# Altium schematic sheet LCD16x2.SchDoc
size A3; SheetNumber: 1; SheetTotal: 1
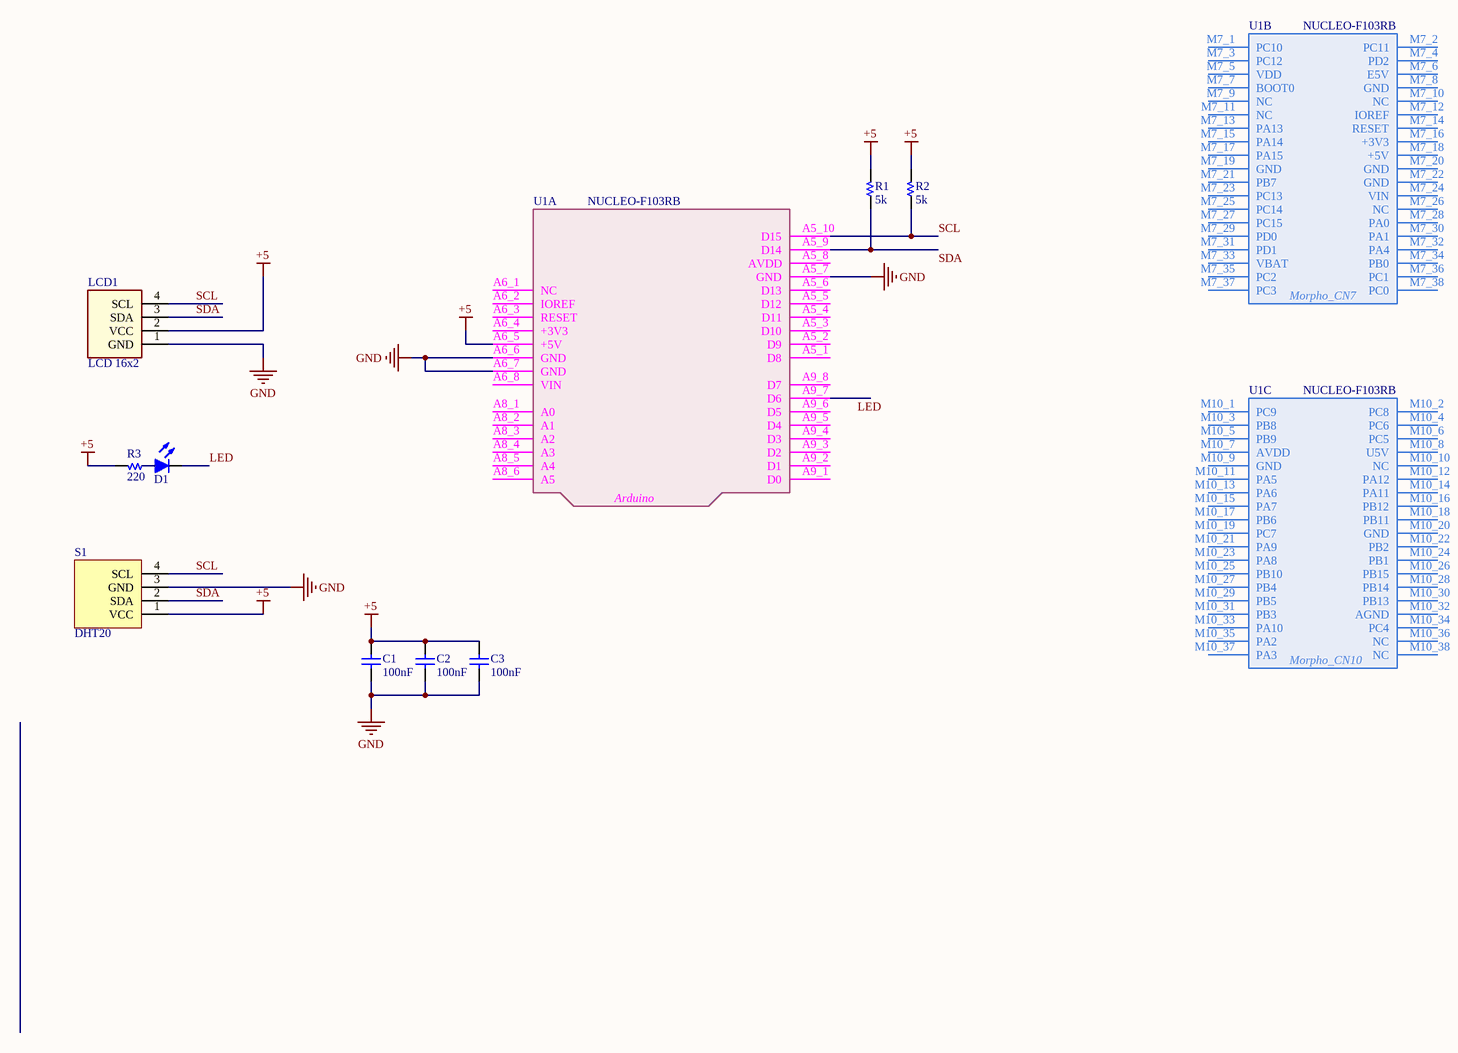
[diagram p0: LCD16x2.SchDoc]

## Parts
C1  100nF  [C 0805]
C2  100nF  [C 0805]
C3  100nF  [C 0805]
D1  Led  [LED 3MM - red]  (value not drawn)
LCD1  LCD 16x2  [LCD 1602A I2C]
R1  5k  [R 0805]
R2  5k  [R 0805]
R3  220  [R 0805]
S1  DHT20  [DTH20]
U1  NUCLEO-F103RB  [NUCLEO]  (parts A,B,C of 3)

## Nets
+5: C1.1 C2.1 C3.1 LCD1.2(VCC) R1.2 R2.2 R3.2 S1.1(VCC) U1.A6_5(+5V)
GND: C1.2 C2.2 C3.2 LCD1.1(GND) S1.3(GND) U1.A5_7(GND) U1.A6_6(GND) U1.A6_7(GND)
LED: D1.2(K) U1.A9_7(D6)
SCL: LCD1.4(SCL) R2.1 S1.4(SCL) U1.A5_10(D15)
SDA: LCD1.3(SDA) R1.1 S1.2(SDA) U1.A5_9(D14)
NetD1_1: D1.1(A) R3.1

Not connected (* = marked no-connect by the designer): U1 A5_1(D8) A5_2(D9) A5_3(D10) A5_4(D11) A5_5(D12) A5_6(D13) A5_8(AVDD) A6_1(NC) A6_2(IOREF) A6_3(RESET) A6_4(+3V3) A6_8(VIN) A8_1(A0) A8_2(A1) A8_3(A2) A8_4(A3) A8_5(A4) A8_6(A5) A9_1(D0) A9_2(D1) A9_3(D2) A9_4(D3) A9_5(D4) A9_6(D5) A9_8(D7) M7_1(PC10) M7_2(PC11) M7_3(PC12) M7_4(PD2) M7_5(VDD) M7_6(E5V) M7_7(BOOT0) M7_8(GND) M7_9(NC) M7_10(NC) M7_11(NC) M7_12(IOREF) M7_13(PA13) M7_14(RESET) M7_15(PA14) M7_16(+3V3) M7_17(PA15) M7_18(+5V) M7_19(GND) M7_20(GND) M7_21(PB7) M7_22(GND) M7_23(PC13) M7_24(VIN) M7_25(PC14) M7_26(NC) M7_27(PC15) M7_28(PA0) M7_29(PD0) M7_30(PA1) M7_31(PD1) M7_32(PA4) M7_33(VBAT) M7_34(PB0) M7_35(PC2) M7_36(PC1) M7_37(PC3) M7_38(PC0) M10_1(PC9) M10_2(PC8) M10_3(PB8) M10_4(PC6) M10_5(PB9) M10_6(PC5) M10_7(AVDD) M10_8(U5V) M10_9(GND) M10_10(NC) M10_11(PA5) M10_12(PA12) M10_13(PA6) M10_14(PA11) M10_15(PA7) M10_16(PB12) M10_17(PB6) M10_18(PB11) M10_19(PC7) M10_20(GND) M10_21(PA9) M10_22(PB2) M10_23(PA8) M10_24(PB1) M10_25(PB10) M10_26(PB15) M10_27(PB4) M10_28(PB14) M10_29(PB5) M10_30(PB13) M10_31(PB3) M10_32(AGND) M10_33(PA10) M10_34(PC4) M10_35(PA2) M10_36(NC) M10_37(PA3) M10_38(NC)

## Notes on the sheet
- (in symbol NUCLEO-F103RB, part A) Arduino
- (in symbol NUCLEO-F103RB, part B) Morpho_CN7
- (in symbol NUCLEO-F103RB, part C) Morpho_CN10

## Library data of the parts
C1-C3 = Capacitor NP: Capacitor non-pol
D1 = Led: Typical LED
LCD1 = LCD 16x2: Character LCD 16x2
R1-R3 = Resistor
S1 = DTH20: DTH20 Temperature and humidity module
U1 = NUCLEO-F103RB: STM32F103RB, mbed-Enabled Development Nucleo-64 STM32F1 ARM® Cortex®-M3 MCU 32-Bit Embedded Evaluation Board; Manufacturer: STMicroelectronics; Manufacturer Product Number: NUCLEO-F103RB; BRAND: STMicroelectronics; PART NO: NUCLEO-F103RB; STOCK CODE: 497-14362-ND; SUPPLIER: digi-key; TYPE: EVAL BRD